# Altium schematic sheet 05.MCU_PC.SchDoc
size 297 x 209 mm
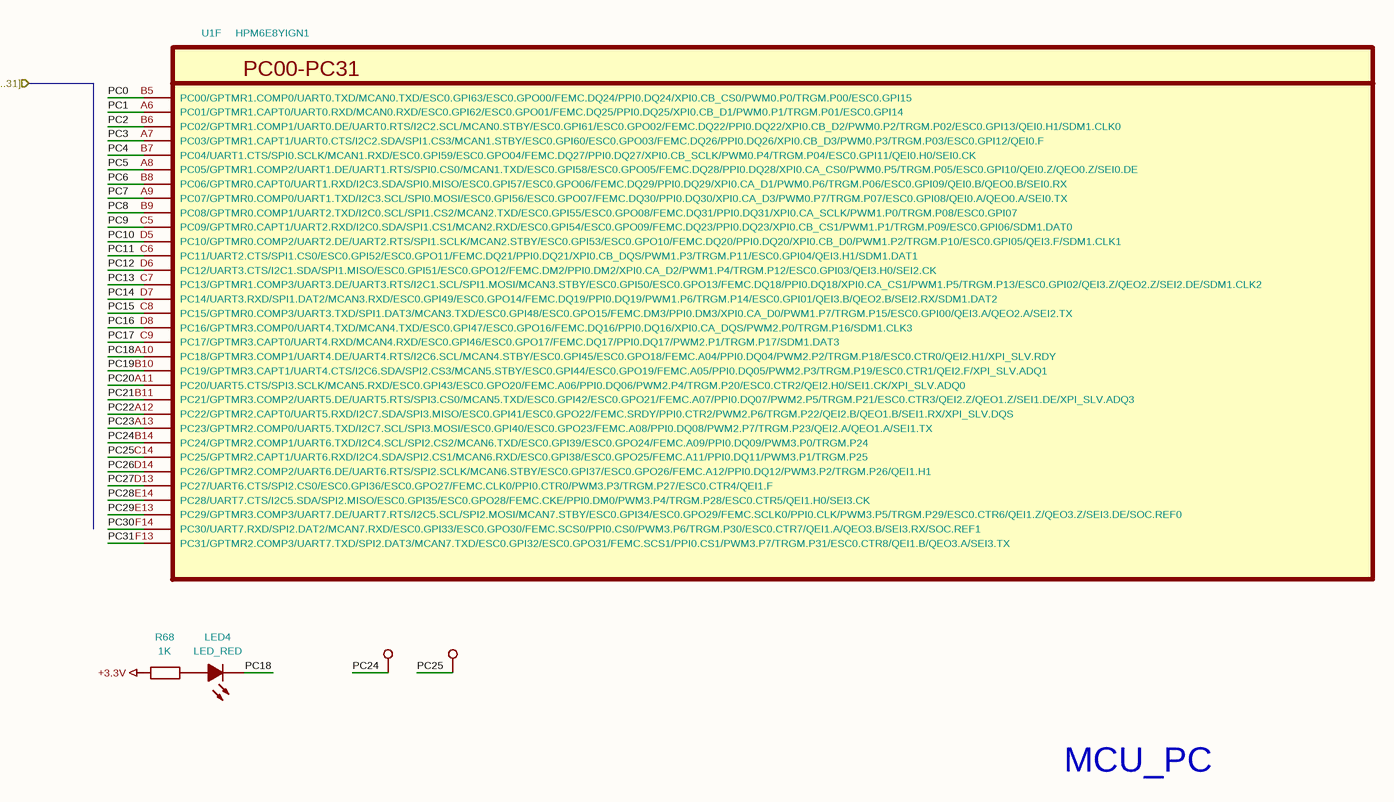
[diagram p0: 05.MCU_PC.SchDoc]

## Parts
LED4  LED_RED  [LED_0603]
R68  1K  [R_0402_1005Metric]
TP33  0.5mm  [TestPoint_Pad_D0.5mm]  (value not drawn)
TP35  0.5mm  [TestPoint_Pad_D0.5mm]  (value not drawn)
U1  HPM6E8YIGN1  [BGA-196_14x14_12.0x12.0mm_P0.8mm]  (part F of 10)

## Ports
PC[0..31] (in)

## Nets
+3.3V: R68.1
PC0: U1.B5(PC00/GPTMR1.COMP0/UART0.TXD/MCAN0.TXD/ESC0.GPI63/ESC0.GPO00/FEMC.DQ24/PPI0.DQ24/XPI0.CB_CS0/PWM0.P0/TRGM.P00/ESC0.GPI15)
PC1: U1.A6(PC01/GPTMR1.CAPT0/UART0.RXD/MCAN0.RXD/ESC0.GPI62/ESC0.GPO01/FEMC.DQ25/PPI0.DQ25/XPI0.CB_D1/PWM0.P1/TRGM.P01/ESC0.GPI14)
PC2: U1.B6(PC02/GPTMR1.COMP1/UART0.DE/UART0.RTS/I2C2.SCL/MCAN0.STBY/ESC0.GPI61/ESC0.GPO02/FEMC.DQ22/PPI0.DQ22/XPI0.CB_D2/PWM0.P2/TRGM.P02/ESC0.GPI13/QEI0.H1/SDM1.CLK0)
PC3: U1.A7(PC03/GPTMR1.CAPT1/UART0.CTS/I2C2.SDA/SPI1.CS3/MCAN1.STBY/ESC0.GPI60/ESC0.GPO03/FEMC.DQ26/PPI0.DQ26/XPI0.CB_D3/PWM0.P3/TRGM.P03/ESC0.GPI12/QEI0.F)
PC4: U1.B7(PC04/UART1.CTS/SPI0.SCLK/MCAN1.RXD/ESC0.GPI59/ESC0.GPO04/FEMC.DQ27/PPI0.DQ27/XPI0.CB_SCLK/PWM0.P4/TRGM.P04/ESC0.GPI11/QEI0.H0/SEI0.CK)
PC5: U1.A8(PC05/GPTMR1.COMP2/UART1.DE/UART1.RTS/SPI0.CS0/MCAN1.TXD/ESC0.GPI58/ESC0.GPO05/FEMC.DQ28/PPI0.DQ28/XPI0.CA_CS0/PWM0.P5/TRGM.P05/ESC0.GPI10/QEI0.Z/QEO0.Z/SEI0.DE)
PC6: U1.B8(PC06/GPTMR0.CAPT0/UART1.RXD/I2C3.SDA/SPI0.MISO/ESC0.GPI57/ESC0.GPO06/FEMC.DQ29/PPI0.DQ29/XPI0.CA_D1/PWM0.P6/TRGM.P06/ESC0.GPI09/QEI0.B/QEO0.B/SEI0.RX)
PC7: U1.A9(PC07/GPTMR0.COMP0/UART1.TXD/I2C3.SCL/SPI0.MOSI/ESC0.GPI56/ESC0.GPO07/FEMC.DQ30/PPI0.DQ30/XPI0.CA_D3/PWM0.P7/TRGM.P07/ESC0.GPI08/QEI0.A/QEO0.A/SEI0.TX)
PC8: U1.B9(PC08/GPTMR0.COMP1/UART2.TXD/I2C0.SCL/SPI1.CS2/MCAN2.TXD/ESC0.GPI55/ESC0.GPO08/FEMC.DQ31/PPI0.DQ31/XPI0.CA_SCLK/PWM1.P0/TRGM.P08/ESC0.GPI07)
PC9: U1.C5(PC09/GPTMR0.CAPT1/UART2.RXD/I2C0.SDA/SPI1.CS1/MCAN2.RXD/ESC0.GPI54/ESC0.GPO09/FEMC.DQ23/PPI0.DQ23/XPI0.CB_CS1/PWM1.P1/TRGM.P09/ESC0.GPI06/SDM1.DAT0)
PC10: U1.D5(PC10/GPTMR0.COMP2/UART2.DE/UART2.RTS/SPI1.SCLK/MCAN2.STBY/ESC0.GPI53/ESC0.GPO10/FEMC.DQ20/PPI0.DQ20/XPI0.CB_D0/PWM1.P2/TRGM.P10/ESC0.GPI05/QEI3.F/SDM1.CLK1)
PC11: U1.C6(PC11/UART2.CTS/SPI1.CS0/ESC0.GPI52/ESC0.GPO11/FEMC.DQ21/PPI0.DQ21/XPI0.CB_DQS/PWM1.P3/TRGM.P11/ESC0.GPI04/QEI3.H1/SDM1.DAT1)
PC12: U1.D6(PC12/UART3.CTS/I2C1.SDA/SPI1.MISO/ESC0.GPI51/ESC0.GPO12/FEMC.DM2/PPI0.DM2/XPI0.CA_D2/PWM1.P4/TRGM.P12/ESC0.GPI03/QEI3.H0/SEI2.CK)
PC13: U1.C7(PC13/GPTMR1.COMP3/UART3.DE/UART3.RTS/I2C1.SCL/SPI1.MOSI/MCAN3.STBY/ESC0.GPI50/ESC0.GPO13/FEMC.DQ18/PPI0.DQ18/XPI0.CA_CS1/PWM1.P5/TRGM.P13/ESC0.GPI02/QEI3.Z/QEO2.Z/SEI2.DE/SDM1.CLK2)
PC14: U1.D7(PC14/UART3.RXD/SPI1.DAT2/MCAN3.RXD/ESC0.GPI49/ESC0.GPO14/FEMC.DQ19/PPI0.DQ19/PWM1.P6/TRGM.P14/ESC0.GPI01/QEI3.B/QEO2.B/SEI2.RX/SDM1.DAT2)
PC15: U1.C8(PC15/GPTMR0.COMP3/UART3.TXD/SPI1.DAT3/MCAN3.TXD/ESC0.GPI48/ESC0.GPO15/FEMC.DM3/PPI0.DM3/XPI0.CA_D0/PWM1.P7/TRGM.P15/ESC0.GPI00/QEI3.A/QEO2.A/SEI2.TX)
PC16: U1.D8(PC16/GPTMR3.COMP0/UART4.TXD/MCAN4.TXD/ESC0.GPI47/ESC0.GPO16/FEMC.DQ16/PPI0.DQ16/XPI0.CA_DQS/PWM2.P0/TRGM.P16/SDM1.CLK3)
PC17: U1.C9(PC17/GPTMR3.CAPT0/UART4.RXD/MCAN4.RXD/ESC0.GPI46/ESC0.GPO17/FEMC.DQ17/PPI0.DQ17/PWM2.P1/TRGM.P17/SDM1.DAT3)
PC18: LED4.1(K) U1.A10(PC18/GPTMR3.COMP1/UART4.DE/UART4.RTS/I2C6.SCL/MCAN4.STBY/ESC0.GPI45/ESC0.GPO18/FEMC.A04/PPI0.DQ04/PWM2.P2/TRGM.P18/ESC0.CTR0/QEI2.H1/XPI_SLV.RDY)
PC19: U1.B10(PC19/GPTMR3.CAPT1/UART4.CTS/I2C6.SDA/SPI2.CS3/MCAN5.STBY/ESC0.GPI44/ESC0.GPO19/FEMC.A05/PPI0.DQ05/PWM2.P3/TRGM.P19/ESC0.CTR1/QEI2.F/XPI_SLV.ADQ1)
PC20: U1.A11(PC20/UART5.CTS/SPI3.SCLK/MCAN5.RXD/ESC0.GPI43/ESC0.GPO20/FEMC.A06/PPI0.DQ06/PWM2.P4/TRGM.P20/ESC0.CTR2/QEI2.H0/SEI1.CK/XPI_SLV.ADQ0)
PC21: U1.B11(PC21/GPTMR3.COMP2/UART5.DE/UART5.RTS/SPI3.CS0/MCAN5.TXD/ESC0.GPI42/ESC0.GPO21/FEMC.A07/PPI0.DQ07/PWM2.P5/TRGM.P21/ESC0.CTR3/QEI2.Z/QEO1.Z/SEI1.DE/XPI_SLV.ADQ3)
PC22: U1.A12(PC22/GPTMR2.CAPT0/UART5.RXD/I2C7.SDA/SPI3.MISO/ESC0.GPI41/ESC0.GPO22/FEMC.SRDY/PPI0.CTR2/PWM2.P6/TRGM.P22/QEI2.B/QEO1.B/SEI1.RX/XPI_SLV.DQS)
PC23: U1.A13(PC23/GPTMR2.COMP0/UART5.TXD/I2C7.SCL/SPI3.MOSI/ESC0.GPI40/ESC0.GPO23/FEMC.A08/PPI0.DQ08/PWM2.P7/TRGM.P23/QEI2.A/QEO1.A/SEI1.TX)
PC24: TP33.1 U1.B14(PC24/GPTMR2.COMP1/UART6.TXD/I2C4.SCL/SPI2.CS2/MCAN6.TXD/ESC0.GPI39/ESC0.GPO24/FEMC.A09/PPI0.DQ09/PWM3.P0/TRGM.P24)
PC25: TP35.1 U1.C14(PC25/GPTMR2.CAPT1/UART6.RXD/I2C4.SDA/SPI2.CS1/MCAN6.RXD/ESC0.GPI38/ESC0.GPO25/FEMC.A11/PPI0.DQ11/PWM3.P1/TRGM.P25)
PC26: U1.D14(PC26/GPTMR2.COMP2/UART6.DE/UART6.RTS/SPI2.SCLK/MCAN6.STBY/ESC0.GPI37/ESC0.GPO26/FEMC.A12/PPI0.DQ12/PWM3.P2/TRGM.P26/QEI1.H1)
PC27: U1.D13(PC27/UART6.CTS/SPI2.CS0/ESC0.GPI36/ESC0.GPO27/FEMC.CLK0/PPI0.CTR0/PWM3.P3/TRGM.P27/ESC0.CTR4/QEI1.F)
PC28: U1.E14(PC28/UART7.CTS/I2C5.SDA/SPI2.MISO/ESC0.GPI35/ESC0.GPO28/FEMC.CKE/PPI0.DM0/PWM3.P4/TRGM.P28/ESC0.CTR5/QEI1.H0/SEI3.CK)
PC29: U1.E13(PC29/GPTMR3.COMP3/UART7.DE/UART7.RTS/I2C5.SCL/SPI2.MOSI/MCAN7.STBY/ESC0.GPI34/ESC0.GPO29/FEMC.SCLK0/PPI0.CLK/PWM3.P5/TRGM.P29/ESC0.CTR6/QEI1.Z/QEO3.Z/SEI3.DE/SOC.REF0)
PC30: U1.F14(PC30/UART7.RXD/SPI2.DAT2/MCAN7.RXD/ESC0.GPI33/ESC0.GPO30/FEMC.SCS0/PPI0.CS0/PWM3.P6/TRGM.P30/ESC0.CTR7/QEI1.A/QEO3.B/SEI3.RX/SOC.REF1)
PC31: U1.F13(PC31/GPTMR2.COMP3/UART7.TXD/SPI2.DAT3/MCAN7.TXD/ESC0.GPI32/ESC0.GPO31/FEMC.SCS1/PPI0.CS1/PWM3.P7/TRGM.P31/ESC0.CTR8/QEI1.B/QEO3.A/SEI3.TX)
NetLED4_2: LED4.2(A) R68.2

## Notes on the sheet
- MCU_PC
- 1
- 2
- 3
- 4
- 5
- 6
- A
- B
- C
- D
- Title: HPM6E8Y_RbMotor_ECAT
- File: 05.MCU_PC.kicad_sch
- Sheet: /
- KiCad E.D.A.  kicad (5.1.4)-1
- Size: A4
- Date: 2023-12-28
- Rev: RevB+
- Id: 1/1
- (in symbol HPM6E8YIGN1, part F) PC00-PC31

## Library data of the parts
LED4 = LED_RED: Model: NCD0603R1; Company: 国星光电; Value: LED_RED; Footprint: 01_HPM_Peripheral:LED_0603
R68 = 1K_0402: Model: 0402WGF1001TCE; Company: UNI-ROYAL(厚声); Value: 1K; Footprint: 02_HPM_Resistor:R_0402_1005Metric
TP33 TP35 = TestPoint-0.5mm: Value: 0.5mm; Footprint: 01_HPM_Peripheral:TestPoint_Pad_D0.5mm
U1 = HPM6E8YIGN1: Value: HPM6E8YIGN1; Footprint: 00_HPM_Library:BGA-196_14x14_12.0x12.0mm_P0.8mm